# EAGLE design ReactanciaCapacitiva (EAGLE 6.3)
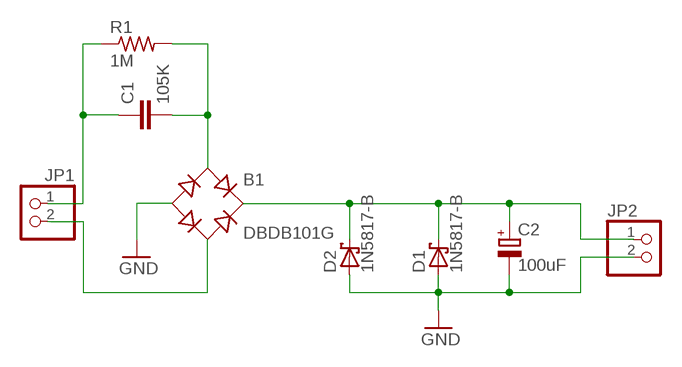
[diagram p0: schematic, sheet 1]

## Parts
B1  DBDB101G  [DB]
C1  105K  C15/7  [C15B7]
C2  100uF  CPOL-EUE2.5-7  [E2,5-7]
D1  1N5817-B  [DO41-7.6]
D2  1N5817-B  [DO41-7.6]
JP1  PINHD-1X2/90  [1X02/90]
JP2  PINHD-1X2  [1X02]
R1  1M  R-US_0204/7  [0204/7]

## Nets
GND: B1.- C2.- D1.A D2.A JP2.2
N$1: C1.1 JP1.1 R1.1
N$2: B1.AC2 JP1.2
N$3: B1.AC1 C1.2 R1.2
N$4: B1.+ C2.+ D1.C D2.C JP2.1

## Library data of the parts
B1 = rectifier:DB?*G: Single Phase 1.0 AMP Glass Passivated Bridge Rectifier Taiwan Semiconductor Co.,Ltd. - TSC Source: http://www.taiwansemi.com/TSCbig5/ezcatfiles/cust/img/img/db101g.pdf http://www.ts.com.tw/db/pictures/modules/PDT/PDT060207001/DBLS201G.pdf
C1 = capacitor-wima:C: CAPACITOR naming: grid - package width
C2 = resistor:CPOL-EU: POLARIZED CAPACITOR, European symbol
D1 D2 = diode:1N581*: 1.0A SCHOTTKY BARRIER RECTIFIER Source: http://www.diodes.com/datasheets/ds23001.pdf
JP1 JP2 = pinhead:PINHD-1X2: PIN HEADER
R1 = resistor:R-US_: RESISTOR, American symbol

## Board
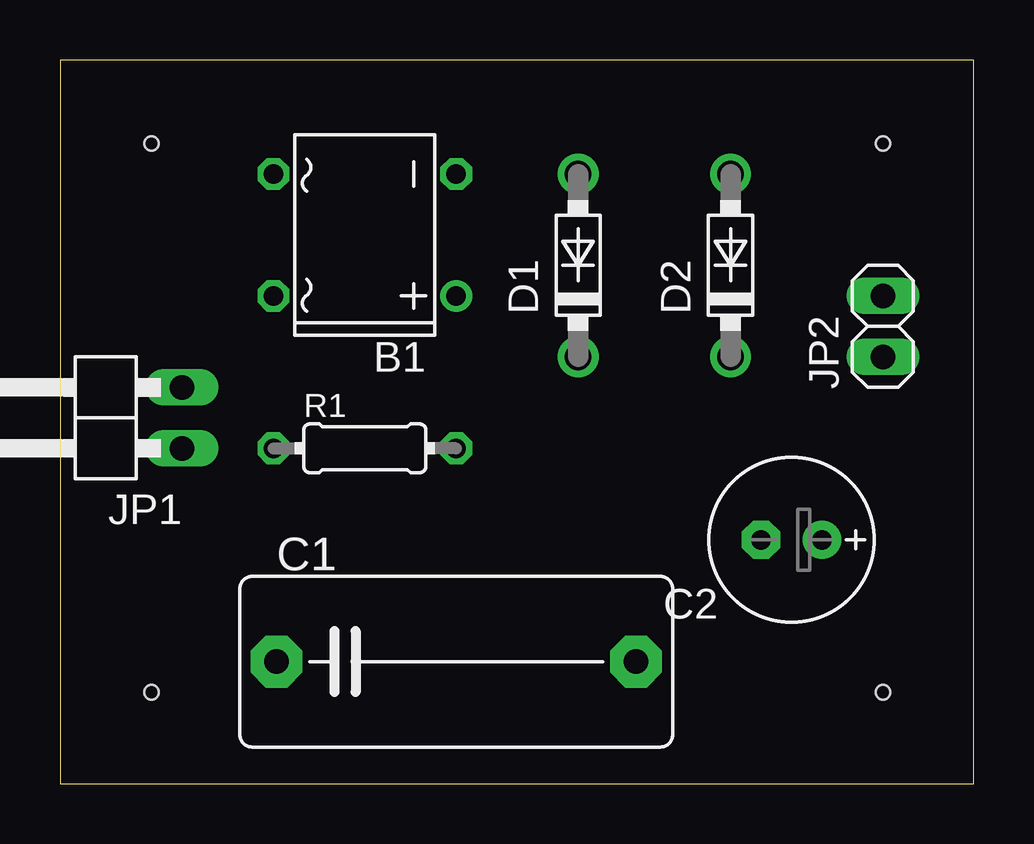
[diagram p1: board, top side]
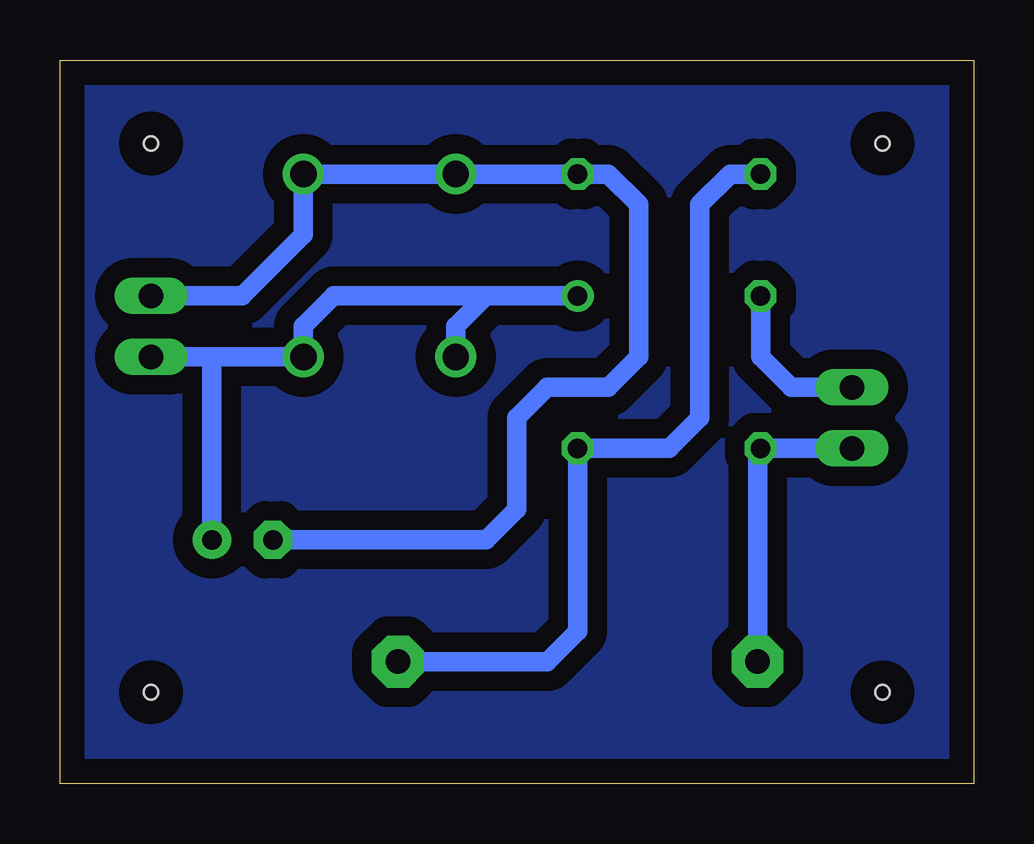
[diagram p2: board, bottom side, seen from below]

Size 38.08 x 30.15 mm. Coordinates in mm from the lower left corner, seen from the top.
Outline: 0,0 38.08,0 38.08,30.15 0,30.15 0,0
Copper layers (1*16): Top 0.035mm / dielectric 1.5mm / Bottom 0.035mm
Design rules "default": minimum track width 10mil, minimum drill 24mil, track to track 8mil, track to pad 8mil, pad to pad 8mil, via to via 8mil, smd to smd 8mil, copper to edge 40mil, drill to drill 8mil, minimum pad ring 10mil, minimum via ring 8mil, stop-mask expansion 4mil, vias tented up to drill 0mil, thermal gap 10mil
Holes 0.6 mm at 3.81,26.67 34.29,3.81 3.81,3.81 34.29,26.67

### Footprints (pad centres in the part's own frame; a part is rotated, then mirrored left to right if it is on the bottom)
DB = drill 0.813: + -2.54,-3.81 | drill 0.813 octagon: - 2.54,-3.81; AC1 2.54,3.81; AC2 -2.54,3.81
C15B7 = drill 1.016 pad 2.159 octagon: 1 -7.493,0; 2 7.493,0
E2,5-7 = drill 0.813 pad 1.6: + -1.27,0 | drill 0.813 pad 1.6 octagon: - 1.27,0
DO41-7.6 = drill 1.1 pad 1.7: A 3.81,0; C -3.81,0
1X02/90 = drill 1.016 long: 1 -1.27,-3.81; 2 1.27,-3.81
1X02 = drill 1.016 long: 1 -1.27,0; 2 1.27,0
0204/7 = drill 0.813 octagon: 1 -3.81,0; 2 3.81,0

### Placement (x,y rotation side)
B1  12.7,22.86 90 top
C1  16.51,5.08 0 top
C2  30.48,10.16 180 top
D1  21.59,21.59 90 top
D2  27.94,21.59 90 top
JP1  1.27,15.24 90 top
JP2  34.29,19.05 90 top
R1  12.7,13.97 0 top

### Tracks (layer width: path | path; a pad name or v marks a point on that pad's centre or on a via)
GND
  Bottom 0.813: C2.- 20.32,10.16 19.05,11.43 19.05,15.24 17.78,16.51 15.24,16.51 13.97,17.78 13.97,24.13 15.24,25.4 B1.- D1.A D2.A 27.94,22.86 30.48,20.32 JP2.2
N$1
  Bottom 0.813: JP1.1 R1.1 9.02,13.84 C1.1
N$2
  Bottom 0.813: JP1.2 7.62,16.51 8.89,17.78 B1.AC2
N$3
  Bottom 0.813: B1.AC1 10.16,25.4 11.43,24.13 11.43,15.24 12.7,13.97 R1.2 16.51,6.35 17.78,5.08 C1.2
N$4
  Bottom 0.813: B1.+ 20.32,20.32 | 20.32,20.32 21.59,19.05 D1.C | 20.32,20.32 26.67,20.32 27.94,19.05 D2.C 31.75,17.78 | 31.75,17.78 JP2.1 | C2.+ 31.75,17.78
N$5
  pour Bottom (isolate 0.813): 0,0 0,30.48 38.1,30.48 38.1,0